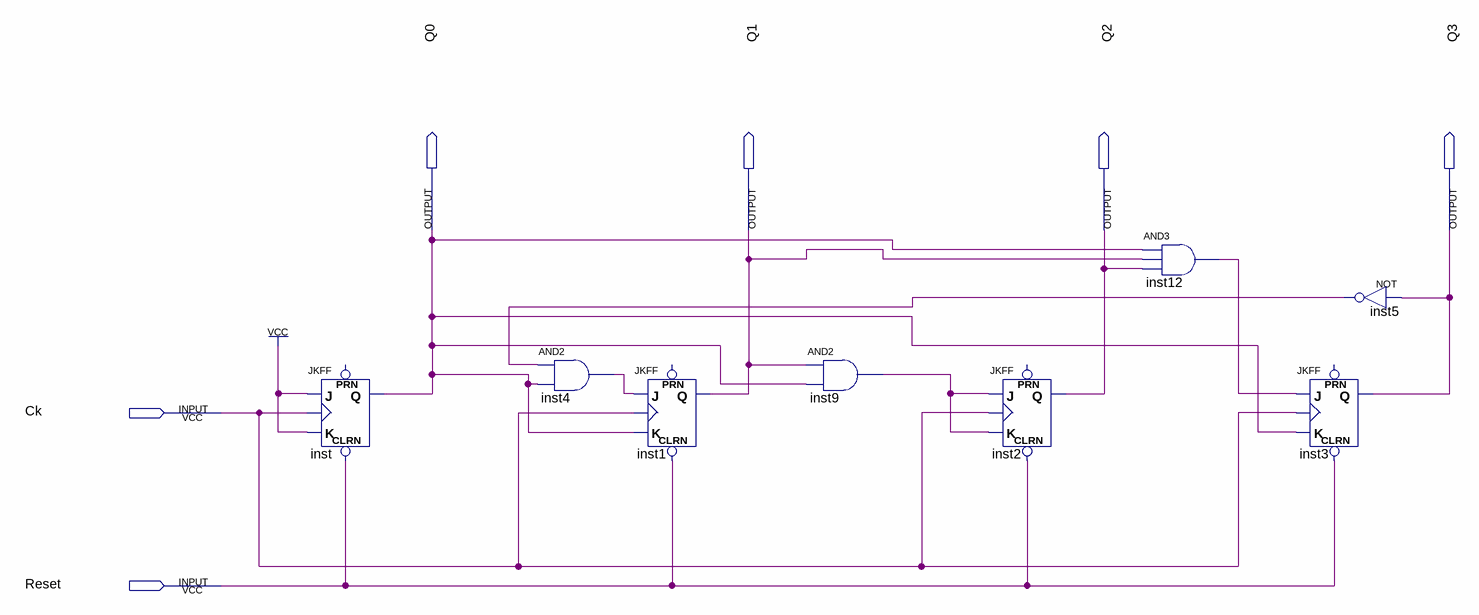
[diagram p0: schematic sheet]
// Quartus schematic Num0_9.bdf as structural Verilog: 8 symbols, 6 pins
module Num0_9 (
  input  Ck,
  input  Reset,
  output Q0,
  output Q1,
  output Q2,
  output Q3
);

  wire inst4_out, inst5_out, inst9_out, inst12_out;

  JKFF inst (.CLRN(Reset), .K(1'b1), .J(1'b1), .CLK(Ck), .Q(Q0));  // open: PRN
  and inst4 (inst4_out, inst5_out, Q0);
  JKFF inst1 (.CLRN(Reset), .K(Q0), .J(inst4_out), .CLK(Ck), .Q(Q1));  // open: PRN
  and inst9 (inst9_out, Q1, Q0);
  JKFF inst2 (.CLRN(Reset), .K(inst9_out), .J(inst9_out), .CLK(Ck), .Q(Q2));  // open: PRN
  and inst12 (inst12_out, Q0, Q1, Q2);
  JKFF inst3 (.CLRN(Reset), .K(Q0), .J(inst12_out), .CLK(Ck), .Q(Q3));  // open: PRN
  not inst5 (inst5_out, Q3);
endmodule
